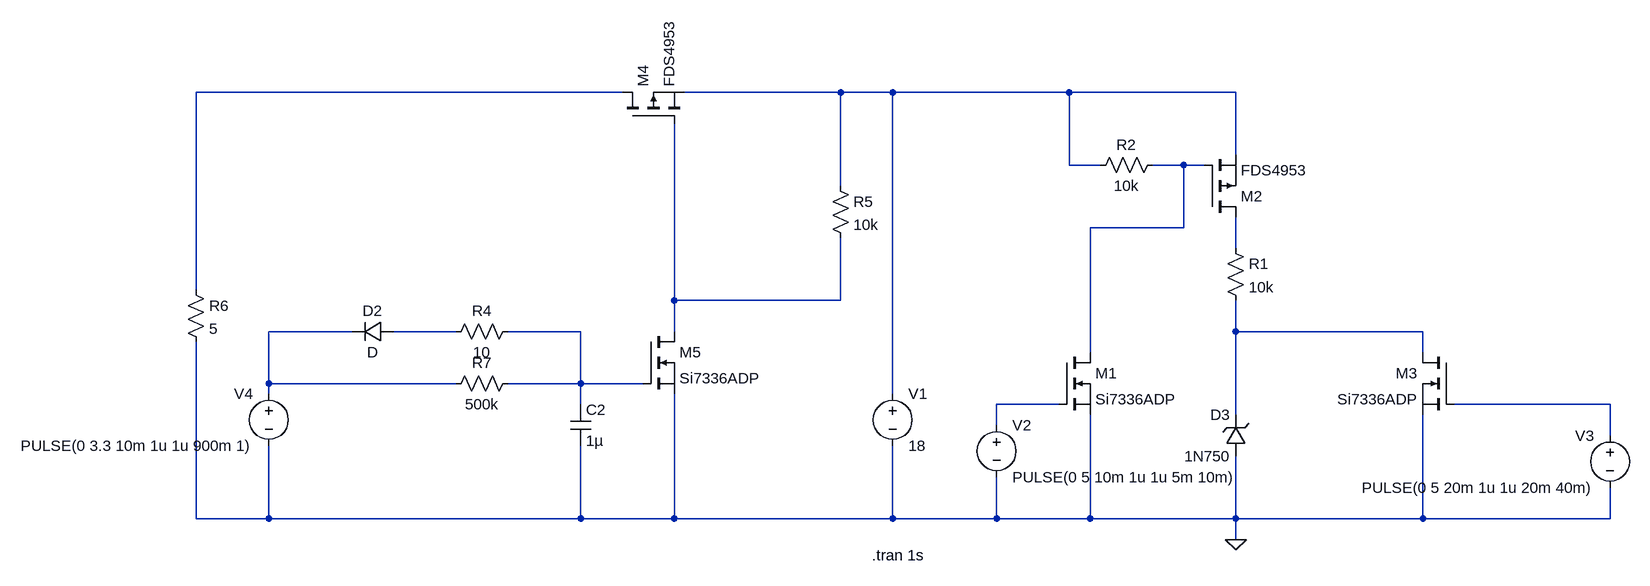
[diagram p0: schematic Regulator_Enable_Simulation.asc]
Regulator_Enable_Simulation.asc, the LTspice schematic file:
Version 4
SHEET 1 1404 680
WIRE -320 -336 -976 -336
WIRE 16 -336 -224 -336
WIRE 96 -336 16 -336
WIRE 368 -336 96 -336
WIRE 624 -336 368 -336
WIRE 624 -240 624 -336
WIRE 368 -224 368 -336
WIRE 416 -224 368 -224
WIRE 544 -224 496 -224
WIRE 576 -224 544 -224
WIRE 16 -192 16 -336
WIRE 544 -128 544 -224
WIRE 544 -128 400 -128
WIRE 624 -96 624 -144
WIRE -976 -32 -976 -336
WIRE -240 -16 -240 -288
WIRE 16 -16 16 -112
WIRE 16 -16 -240 -16
WIRE -736 32 -864 32
WIRE -576 32 -672 32
WIRE -384 32 -496 32
WIRE -240 32 -240 -16
WIRE 624 32 624 -16
WIRE 912 32 624 32
WIRE 400 64 400 -128
WIRE 912 64 912 32
WIRE -864 112 -864 32
WIRE -576 112 -864 112
WIRE -384 112 -384 32
WIRE -384 112 -496 112
WIRE -288 112 -384 112
WIRE -864 128 -864 112
WIRE 96 128 96 -336
WIRE -384 144 -384 112
WIRE 352 144 256 144
WIRE 1200 144 960 144
WIRE 624 160 624 32
WIRE 256 176 256 144
WIRE 1200 192 1200 144
WIRE -976 320 -976 48
WIRE -864 320 -864 208
WIRE -864 320 -976 320
WIRE -384 320 -384 208
WIRE -384 320 -864 320
WIRE -240 320 -240 128
WIRE -240 320 -384 320
WIRE 96 320 96 208
WIRE 96 320 -240 320
WIRE 256 320 256 256
WIRE 256 320 96 320
WIRE 400 320 400 160
WIRE 400 320 256 320
WIRE 624 320 624 224
WIRE 624 320 400 320
WIRE 912 320 912 160
WIRE 912 320 624 320
WIRE 1200 320 1200 272
WIRE 1200 320 912 320
WIRE 624 352 624 320
FLAG 624 352 0
SYMBOL voltage 96 112 R0
WINDOW 123 0 0 Left 0
WINDOW 39 0 0 Left 0
SYMATTR InstName V1
SYMATTR Value 18
SYMBOL nmos 352 64 R0
SYMATTR InstName M1
SYMATTR Value Si7336ADP
SYMBOL voltage 256 160 R0
WINDOW 123 0 0 Left 0
WINDOW 39 0 0 Left 0
SYMATTR InstName V2
SYMATTR Value PULSE(0 5 10m 1u 1u 5m 10m)
SYMBOL zener 640 224 R180
WINDOW 0 24 64 Left 2
WINDOW 3 24 0 Left 2
SYMATTR InstName D3
SYMATTR Value 1N750
SYMBOL pmos 576 -144 M180
SYMATTR InstName M2
SYMATTR Value FDS4953
SYMBOL res 512 -240 R90
WINDOW 0 0 56 VBottom 2
WINDOW 3 32 56 VTop 2
SYMATTR InstName R2
SYMATTR Value 10k
SYMBOL res 608 -112 R0
SYMATTR InstName R1
SYMATTR Value 10k
SYMBOL voltage 1200 176 M0
WINDOW 123 0 0 Left 0
WINDOW 39 0 0 Left 0
SYMATTR InstName V3
SYMATTR Value PULSE(0 5 20m 1u 1u 20m 40m)
SYMBOL nmos 960 64 M0
SYMATTR InstName M3
SYMATTR Value Si7336ADP
SYMBOL pmos -320 -288 R270
SYMATTR InstName M4
SYMATTR Value FDS4953
SYMBOL nmos -288 32 R0
SYMATTR InstName M5
SYMATTR Value Si7336ADP
SYMBOL res -992 -48 R0
SYMATTR InstName R6
SYMATTR Value 5
SYMBOL voltage -864 112 M0
WINDOW 123 0 0 Left 0
WINDOW 39 0 0 Left 0
SYMATTR InstName V4
SYMATTR Value PULSE(0 3.3 10m 1u 1u 900m 1)
SYMBOL res 0 -208 R0
SYMATTR InstName R5
SYMATTR Value 10k
SYMBOL res -480 96 R90
WINDOW 0 0 56 VBottom 2
WINDOW 3 32 56 VTop 2
SYMATTR InstName R7
SYMATTR Value 500k
SYMBOL cap -400 144 R0
SYMATTR InstName C2
SYMATTR Value 1µ
SYMBOL diode -672 16 R90
WINDOW 0 0 32 VBottom 2
WINDOW 3 32 32 VTop 2
SYMATTR InstName D2
SYMBOL res -480 16 R90
WINDOW 0 0 56 VBottom 2
WINDOW 3 32 56 VTop 2
SYMATTR InstName R4
SYMATTR Value 10
TEXT 64 376 Left 2 !.tran 1s

The netlist it stands for:
* Regulator_Enable_Simulation.asc
V1 N002 0 18
M1 N003 N010 0 0 Si7336ADP
V2 N010 0 PULSE(0 5 10m 1u 1u 5m 10m)
D3 0 N009 1N750
M2 N004 N003 N002 N002 FDS4953
R2 N003 N002 10k
R1 N004 N009 10k
V3 N011 0 PULSE(0 5 20m 1u 1u 20m 40m)
M3 N009 N011 0 0 Si7336ADP
M4 N001 N005 N002 N002 FDS4953
M5 N005 N008 0 0 Si7336ADP
R6 N001 0 5
V4 N006 0 PULSE(0 3.3 10m 1u 1u 900m 1)
R5 N002 N005 10k
R7 N008 N006 500k
C2 N008 0 1µ
D2 N007 N006 D
R4 N008 N007 10
.model D D
.lib standard.dio
.model NMOS NMOS
.model PMOS PMOS
.lib standard.mos
.tran 1s
.backanno
.end